# EAGLE design BusPirate-v3b-ftdi-0.1 (EAGLE 5.10)
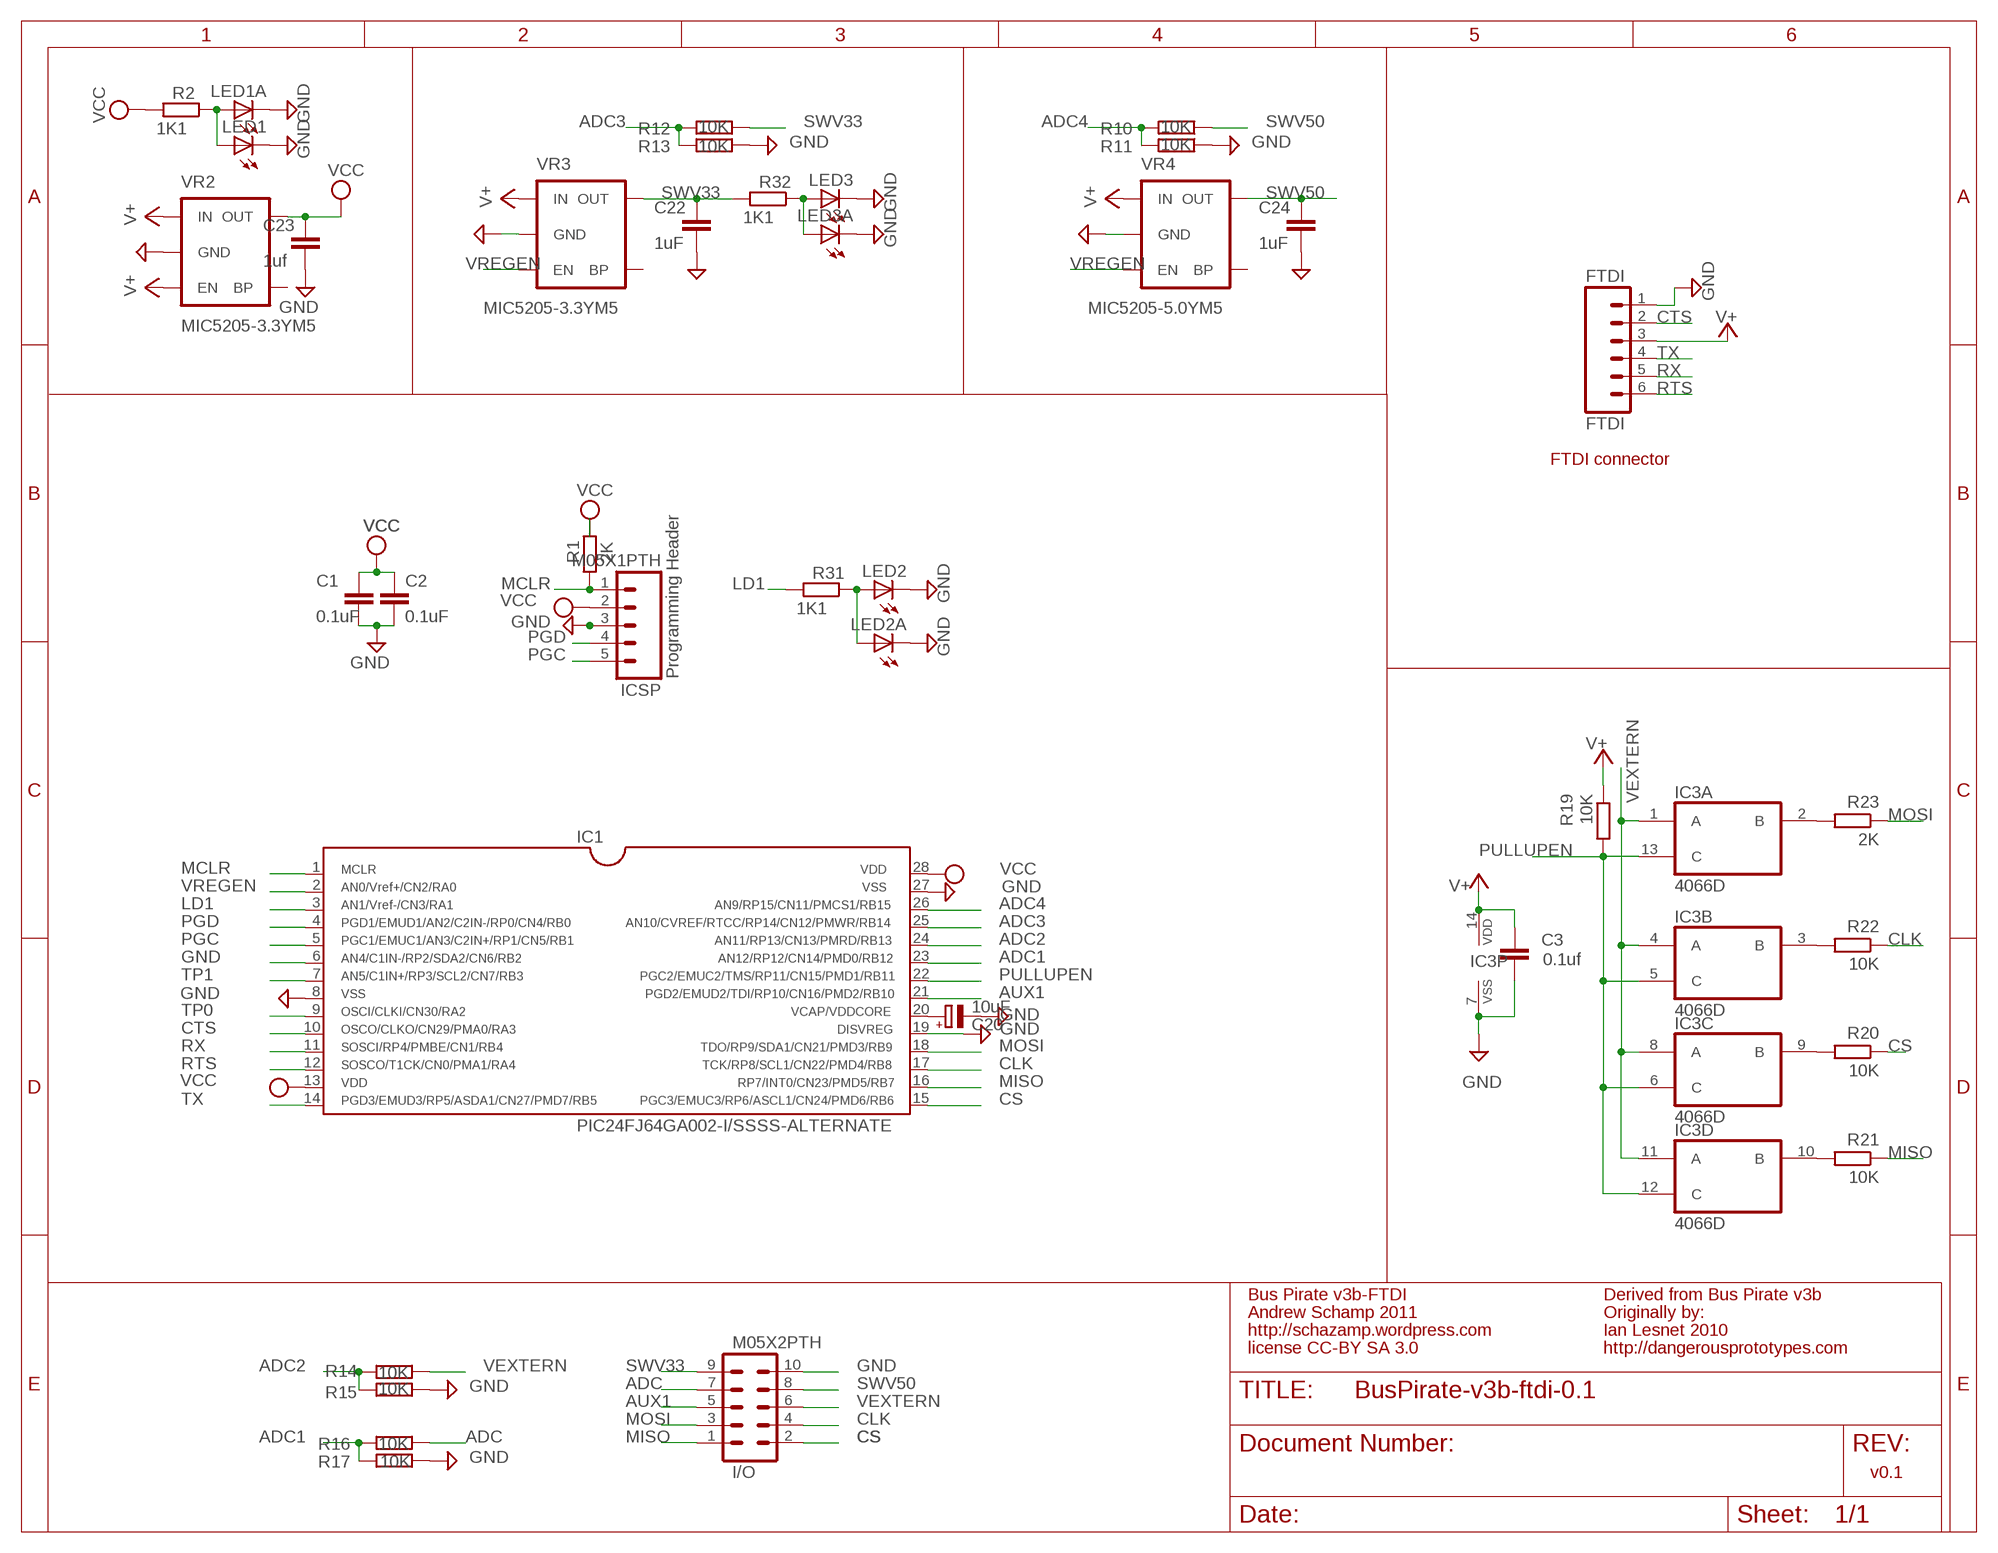
[diagram p0: schematic, sheet 1]

## Parts
C1  0.1uF  C-EUC0805  [C0805]
C2  0.1uF  C-EUC0805  [C0805]
C3  0.1uf  C-EUC0805  [C0805]
C20  10uF  CPOL-EUSMCA  [SMC_A]
C22  1uF  C-EUC0805  [C0805]
C23  1uf  C-EUC0805  [C0805]
C24  1uF  C-EUC0805  [C0805]
FTDI  FTDI  M06LOCK  [1X06_LOCK]
I/O  M05X2PTH  [AVR_ICSP]
IC1  PIC24FJ64GA002-I/SSSS-ALTERNATE  [SSOP28DB]
IC3  4066D  [SO14]
ICSP  M05X1PTH  M05  [1X05]
LED1  LEDCHIP-LED0805  [CHIP-LED0805]
LED1A  LEDCHIP-LED0805  [CHIP-LED0805]
LED2  LEDCHIP-LED0805  [CHIP-LED0805]
LED2A  LEDCHIP-LED0805  [CHIP-LED0805]
LED3  LEDCHIP-LED0805  [CHIP-LED0805]
LED3A  LEDCHIP-LED0805  [CHIP-LED0805]
R1  2K  R-EU_R0805  [R0805]
R2  1K1  R-EU_M0805  [M0805]
R10  10K  R-EU_M0805  [M0805]
R11  10K  R-EU_M0805  [M0805]
R12  10K  R-EU_M0805  [M0805]
R13  10K  R-EU_M0805  [M0805]
R14  10K  R-EU_M0805  [M0805]
R15  10K  R-EU_M0805  [M0805]
R16  10K  R-EU_M0805  [M0805]
R17  10K  R-EU_M0805  [M0805]
R19  10K  R-EU_R0805  [R0805]
R20  10K  R-EU_R0805  [R0805]
R21  10K  R-EU_R0805  [R0805]
R22  10K  R-EU_R0805  [R0805]
R23  2K  R-EU_R0805  [R0805]
R31  1K1  R-EU_M0805  [M0805]
R32  1K1  R-EU_M0805  [M0805]
VR2  MIC5205-3.3YM5  V_REG_LDOSMD  [SOT23-5]
VR3  MIC5205-3.3YM5  V_REG_LDOSMD  [SOT23-5]
VR4  MIC5205-5.0YM5  V_REG_LDOSMD  [SOT23-5]

## Nets
ADC: I/O.7 R16.1
ADC1: IC1.23 R16.2 R17.2
ADC2: IC1.24 R14.2 R15.2
ADC3: IC1.25 R12.2 R13.2
ADC4: IC1.26 R10.2 R11.2
AUX1: I/O.5 IC1.21
CLK: I/O.4 IC1.17 R22.1
CS: I/O.2 IC1.15 R20.1
CTS: FTDI.2 IC1.10
GND: C1.2 C2.2 C3.2 C20.- C22.2 C23.2 C24.2 FTDI.1 I/O.10 IC1.6 IC1.8 IC1.19 IC1.27 IC3.7(P:VSS) ICSP.3 LED1.C LED1A.C LED2.C LED2A.C LED3.C LED3A.C R11.1 R13.1 R15.1 R17.1 VR2.2(GND) VR3.2(GND) VR4.2(GND)
LD1: IC1.3 R31.2
MCLR: IC1.1 ICSP.1 R1.1
MISO: I/O.1 IC1.16 R21.1
MOSI: I/O.3 IC1.18 R23.1
N$1: IC3.2(A:B) R23.2
N$2: IC3.3(B:B) R22.2
N$3: C20.+ IC1.20
N$4: IC3.10(D:B) R21.2
N$5: IC3.9(C:B) R20.2
N$6: LED2.A LED2A.A R31.1
N$7: LED1.A LED1A.A R2.1
N$18: LED3.A LED3A.A R32.1
PGC: IC1.5 ICSP.5
PGD: IC1.4 ICSP.4
PULLUPEN: IC1.22 IC3.5(B:C) IC3.6(C:C) IC3.12(D:C) IC3.13(A:C) R19.2
RTS: FTDI.6 IC1.12
RX: FTDI.5 IC1.11
SWV33: C22.1 I/O.9 R12.1 R32.2 VR3.5(OUT)
SWV50: C24.1 I/O.8 R10.1 VR4.5(OUT)
TP0: IC1.9
TP1: IC1.7
TX: FTDI.4 IC1.14
V+: C3.1 FTDI.3 IC3.14(P:VDD) R19.1 VR2.1(IN) VR2.3(EN) VR3.1(IN) VR4.1(IN)
VCC: C1.1 C2.1 C23.1 IC1.13 IC1.28 ICSP.2 R1.2 R2.2 VR2.5(OUT)
VEXTERN: I/O.6 IC3.1(A:A) IC3.4(B:A) IC3.8(C:A) IC3.11(D:A) R14.1
VREGEN: IC1.2 VR3.3(EN) VR4.3(EN)
Unconnected: VR2.4(BP) VR3.4(BP) VR4.4(BP)

## Notes on the sheet
- FTDI connector
- Programming Header
- Bus Pirate v3b-FTDI | Derived from Bus Pirate v3b
- Andrew Schamp 2011 | Originally by:
- http://schazamp.wordpress.com | Ian Lesnet 2010
- license CC-BY SA 3.0 | http://dangerousprototypes.com
- v0.1

## Library data of the parts
C1-C3 C22-C24 = rcl:C-EU: CAPACITOR, European symbol
C20 = rcl:CPOL-EU: POLARIZED CAPACITOR, European symbol
FTDI = SparkFun:M06: Header 6 Standard 6-pin 0.1" header. Use with straight break away headers (SKU : PRT-00116), right angle break away headers (PRT-00553), swiss pins (PRT-00743), machine pins (PRT-00117), and female headers (PRT-00115). Molex polarized connector foot print use with SKU : PRT-08094 with associated crimp pins and housings. NOTES ON THE VARIANTS LOCK and LOCK_LONGPADS... This footprint was designed to help hold the alignment of a through-hole component (i.e. 6-pin header) while soldering it into place. You may notice that each hole has been shifted either up or down by 0.005 of an inch from it's more standard position (which is a perfectly straight line). This slight alteration caused the pins (the squares in the middle) to touch the edges of the holes. Because they are alternating, it causes a "brace" to hold the component in place. 0.005 has proven to be the perfect amount of "off-center" position when using our standard breakaway headers. Although looks a little odd when you look at the bare footprint, once you have a header in there, the alteration is very hard to notice. Also, if you push a header all the way into place, it is covered up entirely on the bottom side. This idea of altering the position of holes to aid alignment will be further integrated into the Sparkfun Library for other footprints. It can help hold any component with 3 or more connection pins.
I/O = SparkFun:M05X2: Header 5x2 Standard 10-pin dual row 0.1" header. Commonly used with AVR-ISP. Use with Spark Fun Electronics SKU: PRT-00778
IC1 = microchip-pic24:PIC24FJ64GA002-I/SS
IC3 = 40xx:4066: Quad bilateral ANALOG SWITCH
ICSP = SparkFun:M05: Header 5 Standard 5-pin 0.1" header. Use with straight break away headers (SKU : PRT-00116), right angle break away headers (PRT-00553), swiss pins (PRT-00743), machine pins (PRT-00117), and female headers (PRT-00115). Molex polarized connector foot print use with SKU : PRT-08230 with associated crimp pins and housings.
LED1 LED1A LED2 LED2A LED3 LED3A = led:LED: LED OSRAM: - CHIPLED LG R971, LG N971, LY N971, LG Q971, LY Q971, LO R971, LY R971 LH N974, LH R974 LS Q976, LO Q976, LY Q976 LO Q996 - Hyper CHIPLED LW Q18S LB Q993, LB Q99A, LB R99A - SideLED LS A670, LO A670, LY A670, LG A670, LP A670 LB A673, LV A673, LT A673, LW A673 LH A674 LY A675 LS A676, LA A676, LO A676, LY A676, LW A676 LS A679, LY A679, LG A679 - Hyper Micro SIDELED® LS Y876, LA Y876, LO Y876, LY Y876 LT Y87S - SmartLED LW L88C, LW L88S LB L89C, LB L89S, LG L890 LS L89K, LO L89K, LY L89K LS L896, LA L896, LO L896, LY L896 - TOPLED LS T670, LO T670, LY T670, LG T670, LP T670 LSG T670, LSP T670, LSY T670, LOP T670, LYG T670 LG T671, LOG T671, LSG T671 LB T673, LV T673, LT T673, LW T673 LH T674 LS T676, LA T676, LO T676, LY T676, LB T676, LH T676, LSB T676, LW T676 LB T67C, LV T67C, LT T67C, LS T67K, LO T67K, LY T67K, LW E67C LS E67B, LA E67B, LO E67B, LY E67B, LB E67C, LV E67C, LT E67C LW T67C LS T679, LY T679, LG T679 LS T770, LO T770, LY T770, LG T770, LP T770 LB T773, LV T773, LT T773, LW T773 LH T774 LS E675, LA E675, LY E675, LS T675 LS T776, LA T776, LO T776, LY T776, LB T776 LHGB T686 LT T68C, LB T68C - Hyper Mini TOPLED® LB M676 - Mini TOPLED Santana® LG M470 LS M47K, LO M47K, LY M47K Source: http://www.osram.convergy.de LUXEON: - LUMILED® LXK2-PW12-R00, LXK2-PW12-S00, LXK2-PW14-U00, LXK2-PW14-V00 LXK2-PM12-R00, LXK2-PM12-S00, LXK2-PM14-U00 LXK2-PE12-Q00, LXK2-PE12-R00, LXK2-PE12-S00, LXK2-PE14-T00, LXK2-PE14-U00 LXK2-PB12-K00, LXK2-PB12-L00, LXK2-PB12-M00, LXK2-PB14-N00, LXK2-PB14-P00, LXK2-PB14-Q00 LXK2-PR12-L00, LXK2-PR12-M00, LXK2-PR14-Q00, LXK2-PR14-R00 LXK2-PD12-Q00, LXK2-PD12-R00, LXK2-PD12-S00 LXK2-PH12-R00, LXK2-PH12-S00 LXK2-PL12-P00, LXK2-PL12-Q00, LXK2-PL12-R00 Source: www.luxeon.com KINGBRIGHT: KA-3528ASYC Source: www.kingbright.com
R1 R2 R19-R23 R31 R32 = rcl:R-EU_: RESISTOR, European symbol
R10-R17 = resistor:R-EU_: RESISTOR, European symbol
VR2-VR4 = SparkFun:V_REG_LDO: Voltage Regulator LDO Standard 150mA LDO voltage regulator in SOT-23 layout. Micrel part MIC5205. BP (by-pass) pin is used to lower output noise with 470pF cap.

## Board
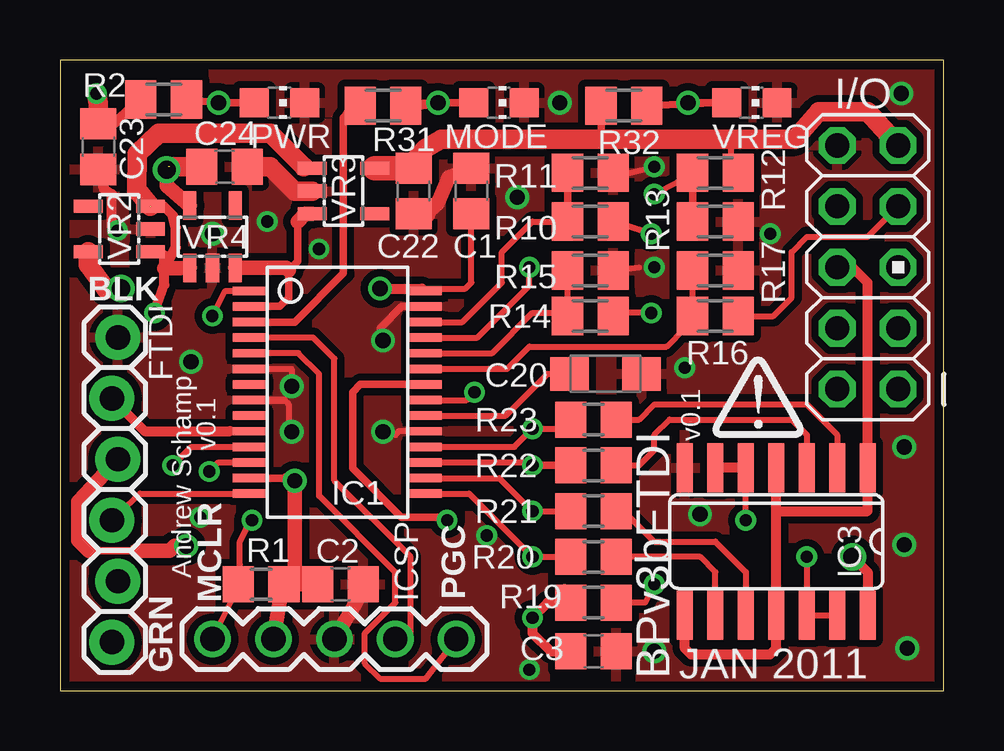
[diagram p1: board, top side]
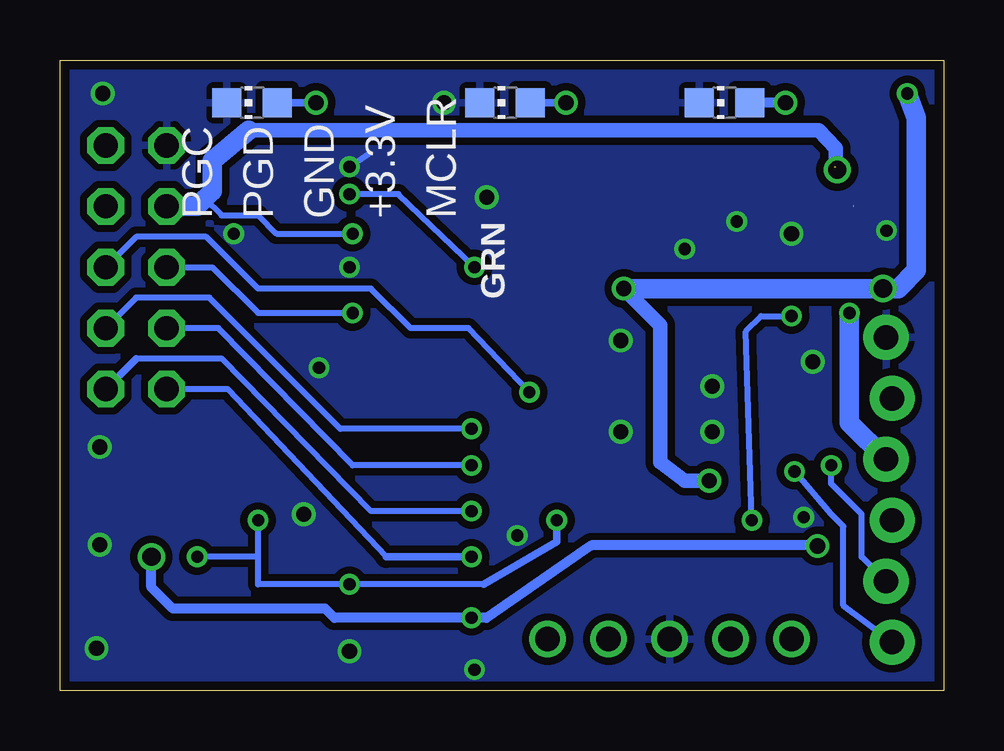
[diagram p2: board, bottom side, seen from below]

Size 36.83 x 26.29 mm. Coordinates in mm from the lower left corner, seen from the top.
Outline: 0,26.29 0,0 36.83,0 36.83,26.29 0,26.29
Copper layers (1*16): Top 0.0356mm / dielectric 1.5011mm / Bottom 0.0356mm
Design rules "LaenPCBOrder-tent": minimum track width 6mil, minimum drill 13mil, track to track 6mil, track to pad 6mil, pad to pad 6mil, via to via 6mil, smd to smd 6mil, copper to edge 15mil, drill to drill 6mil, minimum pad ring 7mil, minimum via ring 7mil, stop-mask expansion 4mil, vias tented up to drill 30mil, thermal gap 10mil

### Footprints (pad centres in the part's own frame; a part is rotated, then mirrored left to right if it is on the bottom)
C0805 = smd 1.3 x 1.5: 1 -0.95,0; 2 0.95,0
SMC_A = smd 1.6 x 1.4: + -1.5,0; - 1.5,0
1X06_LOCK = drill 1.016 pad 1.88 round: 1 0,0; 2 2.54,-0.254; 3 5.08,0; 4 7.62,-0.254; 5 10.16,0; 6 12.7,-0.254
AVR_ICSP = drill 1.016 octagon: 1 -1.27,5.08; 2 1.27,5.08; 3 -1.27,2.54; 4 1.27,2.54; 5 -1.27,0; 6 1.27,0; 7 -1.27,-2.54; 8 1.27,-2.54; 9 -1.27,-5.08; 10 1.27,-5.08
SSOP28DB = smd 0.348 x 1.397: 1 -4.225,-3.656; 2 -3.575,-3.656; 3 -2.925,-3.656; 4 -2.275,-3.656; 5 -1.625,-3.656; 6 -0.975,-3.656; 7 -0.325,-3.656; 8 0.325,-3.656; 9 0.975,-3.656; 10 1.625,-3.656; 11 2.275,-3.656; 12 2.925,-3.656; 13 3.575,-3.656; 14 4.225,-3.656; 15 4.225,3.656; 16 3.575,3.656; 17 2.925,3.656; 18 2.275,3.656; 19 1.625,3.656; 20 0.975,3.656; 21 0.325,3.656; 22 -0.325,3.656; 23 -0.975,3.656; 24 -1.625,3.656; 25 -2.275,3.656; 26 -2.925,3.656; 27 -3.575,3.656; 28 -4.225,3.656
SO14 = smd 0.66 x 2.032: 1 -3.81,-3.073; 2 -2.54,-3.073; 3 -1.27,-3.073; 4 0,-3.073; 5 1.27,-3.073; 6 2.54,-3.073; 7 3.81,-3.073; 8 3.81,3.073; 9 2.54,3.073; 10 1.27,3.073; 11 0,3.073; 12 -1.27,3.073; 13 -2.54,3.073; 14 -3.81,3.073
1X05 = drill 1.016 round: 1 0,0; 2 2.54,0; 3 5.08,0; 4 7.62,0; 5 10.16,0
CHIP-LED0805 = smd 1.2 x 1.2: A 0,-1.05; C 0,1.05
R0805 = smd 1.3 x 1.5: 1 -0.95,0; 2 0.95,0
M0805 = smd 1.3 x 1.6: 1 -0.95,0; 2 0.95,0
SOT23-5 = smd 0.55 x 1.2: 1 -0.95,-1.3; 2 0,-1.3; 3 0.95,-1.3; 4 0.95,1.3; 5 -0.95,1.3

### Placement (x,y rotation side)
C1  17.14,20.83 90 top
C2  11.68,4.45 0 top
C3  22.23,1.65 0 top
C20  22.73,13.21 0 top
C22  14.73,20.83 270 top
C23  1.6,22.68 270 top
C24  6.86,21.84 0 top
FTDI  2.41,14.73 270 top
I/O  33.66,17.65 180 top
IC1  11.56,12.45 270 top
IC3  29.84,6.22 180 top
ICSP  6.35,2.16 0 top
LED1  9.14,24.51 270 top
LED1A  9.14,24.51 90 bottom
LED2  18.29,24.51 270 top
LED2A  18.29,24.51 90 bottom
LED3  28.83,24.51 270 top
LED3A  28.83,24.51 90 bottom
R1  8.38,4.45 0 top
R2  4.32,24.64 180 top
R10  22.1,19.56 180 top
R11  22.1,21.59 180 top
R12  27.3,21.59 180 top
R13  27.3,19.56 180 top
R14  22.1,15.62 180 top
R15  22.1,17.53 180 top
R16  27.3,15.62 180 top
R17  27.3,17.53 180 top
R19  22.23,3.68 0 top
R20  22.23,5.59 0 top
R21  22.23,7.49 0 top
R22  22.23,9.4 0 top
R23  22.23,11.3 0 top
R31  13.46,24.38 180 top
R32  23.5,24.38 180 top
U$1  [DP-LOGO]  27.18,10.54 0 top
VR2  2.47,19.25 90 top
VR3  11.81,20.83 270 top
VR4  6.35,18.92 0 top

### Tracks (layer width: path | path; a pad name or v marks a point on that pad's centre or on a via)
ADC
  Top 0.254: I/O.7 33.66,18.92 31.11,18.92 30.48,18.29 30.48,16.38 29.72,15.62 R16.1
ADC1
  Top 0.254: R17.2 R16.2 26.36,15.11 26.04,15.11 25.27,14.35 19.56,14.35 18.63,13.42 IC1.23
ADC2
  Top 0.254: R15.2 R14.2 21.15,15.75 19.68,15.75 18.01,14.07 IC1.24
ADC3  (via drill 0.51)
  Top 0.254: v19.56,17.65 19.56,16.89 17.39,14.72 IC1.25 | v24.77,20.7 26.23,21.46 R12.2
  Top 0.305: R13.2 R12.2 26.36,21.78
  Bottom 0.254: v24.77,20.7 22.73,20.7 v19.56,17.65
ADC4
  Top 0.254: IC1.26 16.77,15.37 18.41,17.02 18.41,18.29 19.68,19.56 R10.2
  Top 0.305: R10.2 R11.2
  Top 0.406: R10.2 20.95,19.56
AUX1  (via drill 0.51)
  Top 0.254: IC1.21 16.95,12.12 v17.27,12.45
  Bottom 0.254: I/O.5 33.66,18.92 30.73,18.92 28.57,16.76 23.88,16.76 22.23,15.11 19.81,15.11 v17.27,12.45
CLK  (via drill 0.51)
  Top 0.254: IC1.17 19.56,9.52 v19.68,9.4
  Top 0.305: v19.68,9.4 R22.1
  Bottom 0.254: I/O.4 30.23,15.11 24.64,9.4 v19.68,9.4
CS  (via drill 0.51)
  Top 0.254: R20.1 v19.68,5.59 17.14,8.13 17.11,8.16 17.05,8.22 IC1.15
  Bottom 0.254: I/O.2 29.84,12.57 23.24,5.59
  Bottom 0.305: v19.68,5.59 23.24,5.59
CTS
  Top 0.254: 7.09,10.82 IC1.10
  Top 0.406: 7.09,10.82 3.53,10.82 FTDI.2
GND  (via drill 0.51, 0.64)
  Top 0.254: R15.1 24.13,17.65 | 9.34,12.12 9.53,11.94 9.53,10.92 v9.65,10.79 | IC1.19 14.12,10.82 13.97,10.67 | IC1.6 9.65,13.42 v9.65,12.7 | R11.1 23.75,21.59 v24.77,21.84
  Top 0.305: IC1.27 14.24,16.02 13.34,15.11 13.34,14.73 v13.46,14.61 | IC1.8 9.34,12.12
  Top 0.406: C23.2 1.86,20.88 2.16,20.7 2.16,19.33 v2.39,19.18
  Top 0.61: 15.24,19.88 15.75,20.32 16.19,21.4 C1.2 | ICSP.3 12.45,3.88 C2.2
  Top 0.813: VR3.2 9.78,20.83 8.76,21.84 C24.2 | C22.2 15.24,19.88
  Bottom 0.254: v24.77,21.84 24,22.35
  other vias: 26.67,7.37 35.18,6.1 35.31,1.78 26.04,13.46 24.77,17.65 19.05,20.57 20.83,24.51 13.46,10.79 24.77,1.65 35.18,10.16 35.05,24.89 6.35,19.05 5.46,13.72 8.64,19.56 29.59,19.05 5.84,7.24 17.78,6.48 19.56,0.89 10.79,18.41
  pour Top (isolate 0.305): -0.25,26.8 36.7,26.8 36.7,0.13 -0.25,0.13
  pour Bottom (isolate 0.305): 0,26.54 36.7,26.54 36.83,0.13 0.13,0.13
LD1
  Top 0.254: 11.81,23.88 12.06,24.32 R31.2
  Top 0.305: IC1.3 9.78,15.37 11.81,17.4 11.81,23.88
MCLR  (via drill 0.51)
  Top 0.254: IC1.1 6.89,16.67 v6.35,15.62 | v8,7.11 7.75,6.73 7.49,6.22 7.49,5.27 R1.1 7.37,4.19 ICSP.1
  Bottom 0.254: v6.35,15.62 7.62,15.62 8.26,14.99 v8,7.11
MISO  (via drill 0.51)
  Top 0.254: v19.68,7.49 R21.1 | v19.68,7.49 19.58,7.6 | IC1.16 18.31,8.87 v19.68,7.49
  Bottom 0.254: 33.66,13.84 30.1,13.84 23.88,7.49 v19.68,7.49
  Bottom 0.305: 33.66,13.84 I/O.1
MOSI  (via drill 0.51)
  Top 0.254: IC1.18 18.93,10.17 v19.68,10.92 20.89,10.92 R23.1
  Bottom 0.254: I/O.3 33.66,16.38 30.61,16.38 25.15,10.92 v19.68,10.92
N$1
  Top 0.254: IC3.2 32.38,10.67 31.11,11.94 24.77,11.94 24.13,11.3 R23.2
N$2
  Top 0.254: R22.2 24.13,9.4 24.77,10.03 24.77,10.67 25.4,11.3 30.48,11.3 31.11,10.67 IC3.3
N$3
  Top 0.254: IC1.20 18.58,11.47 20.32,13.21 C20.+
N$4
  Top 0.254: R21.2 23.5,7.49 24.77,6.22 27.3,6.22 28.57,4.95 IC3.10
N$5
  Top 0.254: R20.2 26.67,5.59 27.3,4.95 IC3.9
N$6  (via drill 0.64)
  Top 0.305: 15.59,24.48 LED2A.A v15.75,24.51
  Top 0.406: R31.1 15.59,24.48
  Bottom 0.305: v15.75,24.51 LED2A.A
N$7  (via drill 0.64)
  Top 0.305: LED1A.A v6.6,24.51 R2.1
  Bottom 0.406: v6.6,24.51 LED1A.A
N$18  (via drill 0.64)
  Top 0.305: R32.1 27.75,24.54 | LED3A.A v26.16,24.51
  Top 0.406: 27.75,24.54 LED3A.A
  Bottom 0.305: v26.16,24.51 LED3A.A
PGC
  Top 0.254: IC1.5 9.93,14.07 10.79,13.21 10.79,8.13 13.97,4.95 13.97,3.68 12.7,2.41 12.7,1.14 13.34,0.51 15.24,0.51 ICSP.5
PGD
  Top 0.254: IC1.4 10.55,14.72 11.43,13.84 11.43,8.76 14.61,5.59 14.61,2.41 ICSP.4
PULLUPEN  (via drill 0.51)
  Top 0.254: v31.11,5.59 IC3.12 IC3.13 | v28.57,7.11 IC3.5 | R19.2 24.38,3.68 v24.77,4.45
  Top 0.305: IC1.22 12.52,12.77 12.19,12.45 12.19,9.27 14.22,7.24 16,7.24 v16.13,7.11
  Top 0.406: IC3.5 IC3.6
  Bottom 0.254: 28.57,5.59 28.57,4.45 v24.77,4.45 19.18,4.45 | 28.57,5.59 v28.57,7.11 | 28.57,5.59 v31.11,5.59
  Bottom 0.305: v16.13,7.11 16.13,6.22 19.18,4.45
RTS  (via drill 0.51)
  Top 0.254: IC1.12 6.6,9.52 v6.22,9.14
  Bottom 0.254: v6.22,9.14 4.7,7.37 4.19,6.86 4.19,3.56 FTDI.6
RX  (via drill 0.51)
  Top 0.254: IC1.11 5.47,10.17 v4.7,9.4
  Bottom 0.254: FTDI.5 3.43,5.59 3.43,7.37 4.7,8.64 v4.7,9.4
SWV33
  Top 0.254: R12.1 27.94,21.46 27.94,22.99
  Top 0.305: 22.55,22.8 R32.2
  Top 0.406: R32.2 22.67,24.51 | 24.64,22.99 22.55,22.8
  Top 0.61: 14.48,21.78 C22.1 13.93,21.78
  Top 0.813: I/O.9 33.66,24.13 31.62,24.13 30.61,22.99 27.94,22.99 24.64,22.99 15.88,22.99 15.24,22.61 14.48,21.78
  Top 1.016: 13.93,21.78 VR3.5
SWV50  (via drill 0.51, 0.76)  (1 unrouted)
  Top 0.254: v24.64,19.05 R10.1
  Top 0.61: 4.45,21.65 4.45,21.05 VR4.5
  Top 0.762: 4.45,21.65 v4.45,21.72
  Top 0.813: C24.1 4.57,21.84 v4.45,21.72
  Bottom 0.254: v24.64,19.05 27.81,19.05 28.57,19.81 30.1,19.81 30.8,20.51
  Bottom 0.61: 28.96,23.37 5.21,23.37 4.51,22.61 4.51,21.84
  Bottom 0.813: I/O.8 31.11,20.19 30.8,20.51 30.48,20.83 30.48,22.1 28.96,23.37
TX
  Top 0.254: IC1.14 3.34,8.22 FTDI.4
V+  (via drill 0.51, 0.64, 0.76)  (1 unrouted)
  Top 0.254: IC3.14 33.66,2.73 | 21.02,4.25 R19.1 21.27,3.36
  Top 0.305: 1.19,5.84 3.17,5.84
  Top 0.406: 21.02,4.25 21.02,3.75 20.95,3.68 20.32,3.68 v19.68,3.05 19.68,2.41 20.45,1.65 C3.1 | IC3.14 33.66,4.95 v33.02,5.59 | 10.16,21.84 10.45,21.84 VR3.1 | 3.75,20.19 4.32,20.19 4.7,19.81 4.83,19.3 4.83,18.48 4.34,17.62 | 4.34,17.62 4.34,16.92 v3.94,15.75 | 4.34,17.62 4.34,18.13 4.19,18.29 3.53,18.29 VR2.1
  Top 0.61: FTDI.3 0.76,7.87 0.76,6.27 1.19,5.84 | 4.34,17.62 5.02,17.62 VR4.1 | v5.26,6.04 4.77,6.04 4.57,5.84 3.17,5.84
  Top 0.813: 10.16,21.84 8.76,23.24 4.11,23.24 3.21,22.38 3.19,20.83 3.32,20.75 3.75,20.19
  Bottom 0.406: v33.02,5.59 33.02,4.32 32.13,3.43 25.78,3.43 25.4,3.05 v19.68,3.05 19.05,3.05 14.69,6.07 5.29,6.07 v5.26,6.04
  Bottom 0.813: v3.94,15.75 3.94,11.18 FTDI.3
VCC  (via drill 0.51, 0.64, 0.76)
  Top 0.254: R1.2 9.53,4.51 | 15.09,16.76 16.89,16.76 17.14,17.02 C1.1
  Top 0.305: IC1.13 9.67,8.87 v9.78,8.76 | 15.09,16.76 15.12,16.76 IC1.28
  Top 0.406: 10.29,4.51 C2.1 9.78,4.89 | v9.78,8.76 9.42,8.87 | v13.34,16.76 15.09,16.76 | C23.1 1.98,23.37 R2.2
  Top 0.61: C2.1 R1.2 9.27,4.45 ICSP.2 | 9.78,4.89 v9.78,8.76
  Top 0.813: VR2.5 1.17,17.75 1.91,16.76 v2.54,16.76 | C23.1 1.6,24.46 v1.52,24.89
  Bottom 0.61: v9.78,8.76 10.79,8.76 11.81,9.53 11.81,15.24 v13.34,16.76
  Bottom 0.813: v13.34,16.76 v2.54,16.76 1.91,16.76 1.14,17.53 1.14,23.88 v1.52,24.89
VEXTERN  (via drill 0.51)
  Top 0.254: v24.64,15.75 23.18,15.75 R14.1
  Top 0.406: 29.84,7.49 33.66,7.49 IC3.1 33.66,17.02 33.02,17.65 I/O.6 | IC3.8 26.04,1.78 26.29,1.52 29.59,1.52 29.84,1.78 IC3.11 29.84,7.49 | 29.84,7.49 IC3.4
  Bottom 0.254: I/O.6 30.48,17.65 28.57,15.75 v24.64,15.75
VREGEN
  Top 0.305: IC1.2 9.16,16.02 9.53,16.38 9.53,17.53 9.91,17.91 9.91,19.56
  Top 0.61: VR4.3 9.43,17.62 9.53,17.53 | VR3.3 10.23,19.88 9.91,19.56

### Text on the board
tNames: PWR | MODE | VREG | BLK | v0.1 | v0.1 | Andrew Schamp | MCLR | PGC | GRN | BPv3bFTDI | JAN 2011
bNames: GRN | MCLR | +3.3V | GND | PGD | PGC
Reference: MCLR | +3.3V | GND | DATA | CLOCK